# EAGLE design 328pb_squinch_v1 (EAGLE 7.7.0)
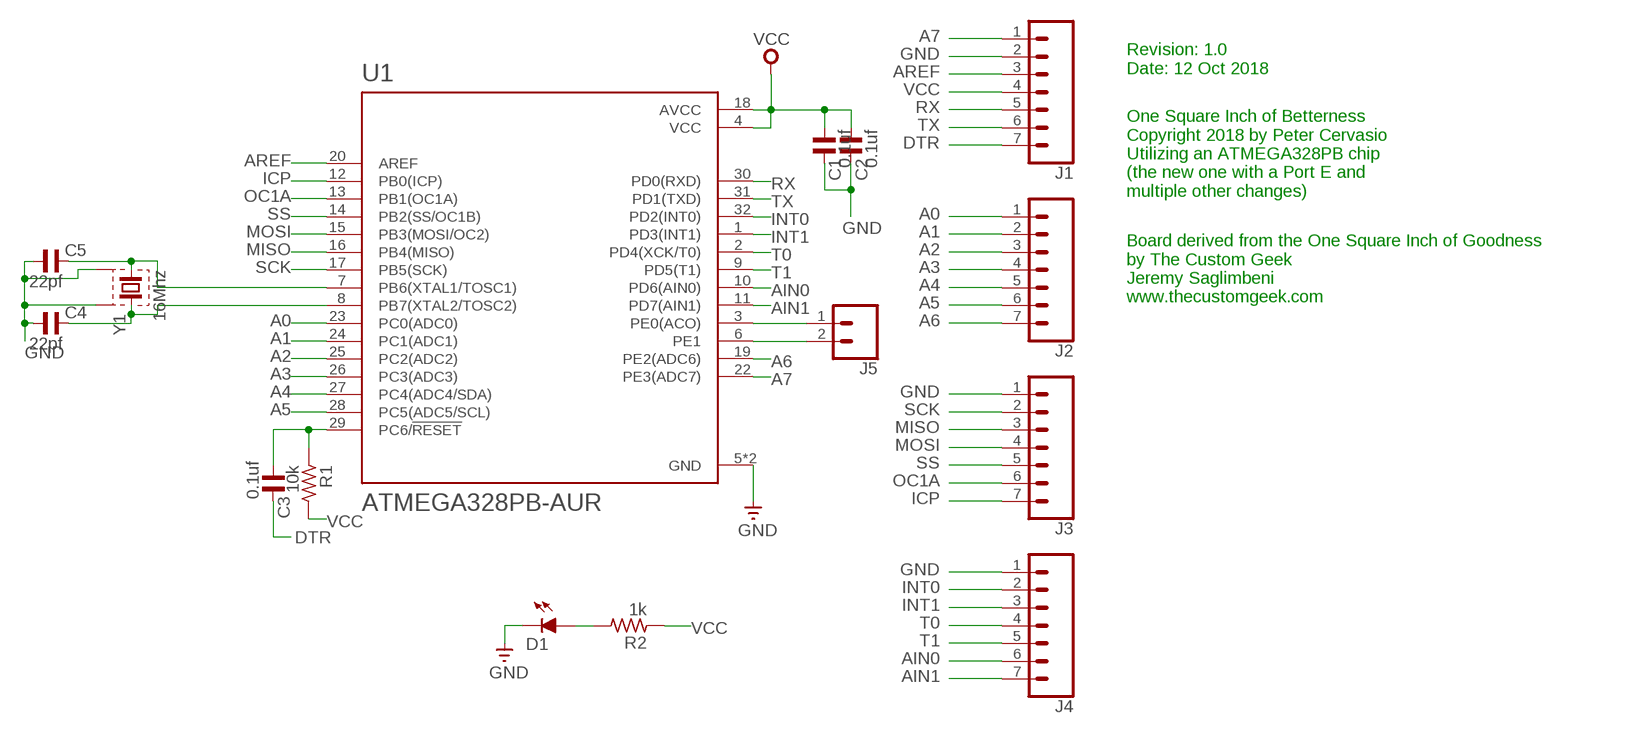
[diagram p0: schematic, sheet 1]

## Parts
C1  0.1uf  C_0603  [C0603]
C2  0.1uf  C_0603  [C0603]
C3  0.1uf  C_0603  [C0603]
C4  22pf  C_0603  [C0603]
C5  22pf  C_0603  [C0603]
D1  LEDCHIPLED_0603  [CHIPLED_0603]
J1  CONN_07  [1X07]
J2  CONN_07  [1X07]
J3  CONN_07  [1X07]
J4  CONN_07  [1X07]
J5  CONN_02  [1X02]
R1  10k  R_0603  [R0603]
R2  1k  R_0603  [R0603]
U1  ATMEGA328PB-AUR  [QFP80P900X900X120-32N]
Y1  16Mhz  ABM3B  [ABM3B]

## Nets
A0: J2.1 U1.23(PC0(ADC0))
A1: J2.2 U1.24(PC1(ADC1))
A2: J2.3 U1.25(PC2(ADC2))
A3: J2.4 U1.26(PC3(ADC3))
A4: J2.5 U1.27(PC4(ADC4/SDA))
A5: J2.6 U1.28(PC5(ADC5/SCL))
A6: J2.7 U1.19(PE2(ADC6))
A7: J1.1 U1.22(PE3(ADC7))
AIN0: J4.6 U1.10(PD6(AIN0))
AIN1: J4.7 U1.11(PD7(AIN1))
AREF: J1.3 U1.20(AREF)
DTR: C3.2 J1.7
GND: C1.1 C2.1 C4.1 C5.1 D1.C J1.2 J3.1 J4.1 U1.5(GND) U1.21(GND) Y1.2 Y1.4
ICP: J3.7 U1.12(PB0(ICP))
INT0: J4.2 U1.32(PD2(INT0))
INT1: J4.3 U1.1(PD3(INT1))
MISO: J3.3 U1.16(PB4(MISO))
MOSI: J3.4 U1.15(PB3(MOSI/OC2))
N$8: C5.2 U1.7(PB6(XTAL1/TOSC1)) Y1.1
N$9: C4.2 U1.8(PB7(XTAL2/TOSC2)) Y1.3
N$16: C3.1 R1.1 U1.29(PC6/!RESET)
N$44: D1.A R2.2
OC1A: J3.6 U1.13(PB1(OC1A))
PE0: J5.1 U1.3(PE0(ACO))
PE1: J5.2 U1.6(PE1)
RX: J1.5 U1.30(PD0(RXD))
SCK: J3.2 U1.17(PB5(SCK))
SS: J3.5 U1.14(PB2(SS/OC1B))
T0: J4.4 U1.2(PD4(XCK/T0))
T1: J4.5 U1.9(PD5(T1))
TX: J1.6 U1.31(PD1(TXD))
VCC: C1.2 C2.2 J1.4 R1.2 R2.1 U1.4(VCC) U1.18(AVCC)

## Notes on the sheet
- Revision: 1.0
  Date: 12 Oct 2018
- One Square Inch of Betterness
  Copyright 2018 by Peter Cervasio
  Utilizing an ATMEGA328PB chip
  (the new one with a Port E and
  multiple other changes)
- Board derived from the One Square Inch of Goodness
  by The Custom Geek
  Jeremy Saglimbeni
  www.thecustomgeek.com

## Library data of the parts
C1-C5 = rc-master-smd:C_: NON-POLARIZED CAP
D1 = led:LED: LED Various Types
J1-J4 = SparkFun-Connectors:CONN_07: Multi connection point. Often used as Generic Header-pin footprint for 0.1 inch spaced/style header connections On any of the 0.1 inch spaced packages, you can populate with these: Break Away Headers - Straight <https://www.sparkfun.com/products/116> (PRT-00116) Break Away Male Headers - Right Angle <https://www.sparkfun.com/products/553> (PRT-00553) Female Headers <https://www.sparkfun.com/products/115> (PRT-00115) Break Away Headers - Machine Pin <https://www.sparkfun.com/products/117> (PRT-00117) Break Away Female Headers - Swiss Machine Pin <https://www.sparkfun.com/products/743> (PRT-00743) For SCREWTERMINALS and SPRING TERMINALS visit here: Screw Terimnals on SparkFun.com <https://www.sparkfun.com/search/results?term=Screw+Terminals> (5mm/3.5mm/2.54mm spacing) This device is also useful as a general connection point to wire up your design to another part of your project. Our various solder wires solder well into these plated through hole pads. Hook-Up Wire - Assortment (Stranded, 22 AWG) <https://www.sparkfun.com/products/11375> (PRT-11375) Hook-Up Wire - Assortment (Solid Core, 22 AWG) <https://www.sparkfun.com/products/11367> (PRT-11367) View the entire wire category on our website here <https://www.sparkfun.com/categories/141> Special notes: Molex polarized connector foot print use with SKU : PRT-08231 with associated crimp pins and housings. 1MM SMD Version SKU: PRT-10208 NOTES ON THE VARIANTS LOCK and LOCK_LONGPADS... This footprint was designed to help hold the alignment of a through-hole component (i.e. 6-pin header) while soldering it into place. You may notice that each hole has been shifted either up or down by 0.005 of an inch from it's more standard position (which is a perfectly straight line). This slight alteration caused the pins (the squares in the middle) to touch the edges of the holes. Because they are alternating, it causes a "brace" to hold the component in place. 0.005 has proven to be the perfect amount of "off-center" position when using our standard breakaway headers. Although looks a little odd when you look at the bare footprint, once you have a header in there, the alteration is very hard to notice. Also,if you push a header all the way into place, it is covered up entirely on the bottom side.
J5 = SparkFun-Connectors:CONN_02: Multi connection point. Often used as Generic Header-pin footprint for 0.1 inch spaced/style header connections On any of the 0.1 inch spaced packages, you can populate with these: Break Away Headers - Straight <https://www.sparkfun.com/products/116> (PRT-00116) Break Away Male Headers - Right Angle <https://www.sparkfun.com/products/553> (PRT-00553) Female Headers <https://www.sparkfun.com/products/115> (PRT-00115) Break Away Headers - Machine Pin <https://www.sparkfun.com/products/117> (PRT-00117) Break Away Female Headers - Swiss Machine Pin <https://www.sparkfun.com/products/743> (PRT-00743) For SCREWTERMINALS and SPRING TERMINALS visit here: Screw Terimnals on SparkFun.com <https://www.sparkfun.com/search/results?term=Screw+Terminals> (5mm/3.5mm/2.54mm spacing) This device is also useful as a general connection point to wire up your design to another part of your project. Our various solder wires solder well into these plated through hole pads. Hook-Up Wire - Assortment (Stranded, 22 AWG) <https://www.sparkfun.com/products/11375> (PRT-11375) Hook-Up Wire - Assortment (Solid Core, 22 AWG) <https://www.sparkfun.com/products/11367> (PRT-11367) View the entire wire category on our website here <https://www.sparkfun.com/categories/141> Special notes: Molex polarized connector foot print use with: PRT-08233 with associated crimp pins and housings. 2.54_SCREWTERM for use with PRT-10571. 3.5mm Screw Terminal footprints for PRT-08084 5mm Screw Terminal footprints for use with PRT-08432
R1 R2 = rc-master-smd:R_: RESISTOR
U1 = ATMEGA328PB-AUR:ATMEGA328PB-AUR: ATmega Series 20 MHz 32 KB Flash 2 KB SRAM 8-Bit Microcontroller - TQFP-32; AVAILABILITY: Unavailable; DESCRIPTION: Avr 32kb f , 1kb Eeprom, 2kb Ram, - 20mhz, Tqfp, Ind Temp, Green 5 v t&r; MF: Microchip; MP: ATMEGA328PB-AUR; PACKAGE: TQFP-32 Atmel; PRICE: None
Y1 = crystal:ABM3B: CRYSTAL - ABRACON ABM3B Series, 5.0 x 3.2 mm

## Board
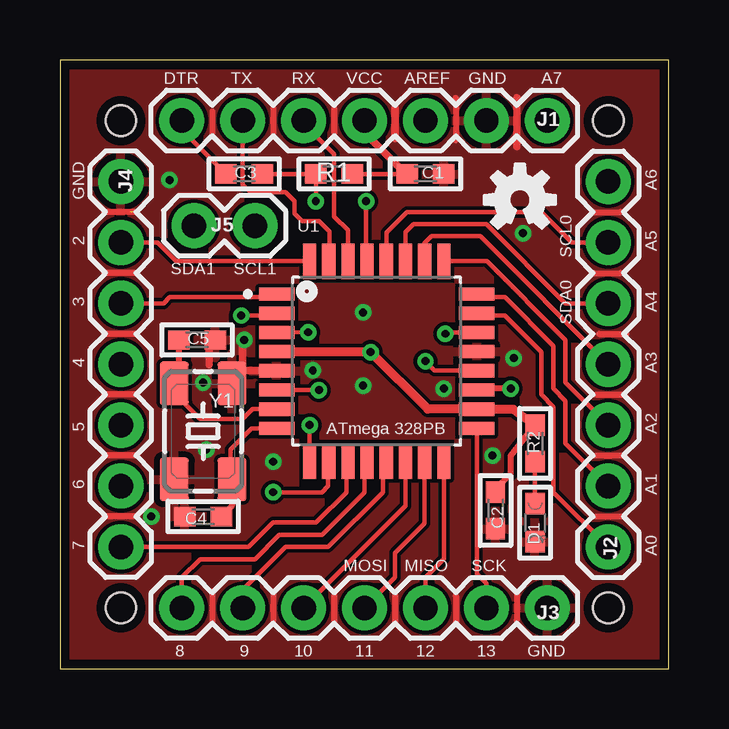
[diagram p1: board, top side]
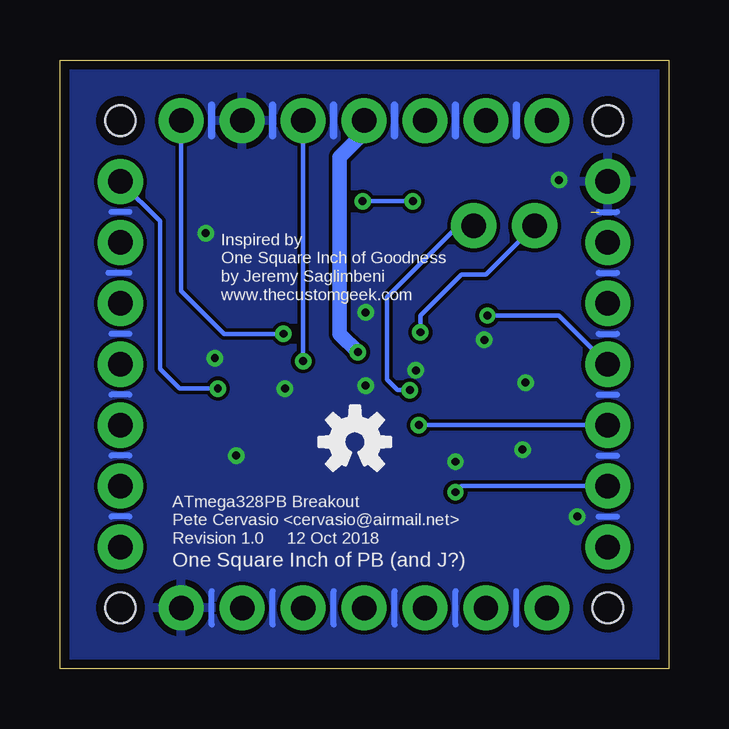
[diagram p2: board, bottom side, seen from below]

Size 25.38 x 25.39 mm. Coordinates in mm from the lower left corner, seen from the top.
Outline: 0,0 25.38,0 25.38,25.39 0,25.39 0,0
Copper layers (1*16): Top 0.0356mm / dielectric 1.5011mm / Bottom 0.0356mm
Design rules "oshpark-2layer": minimum track width 6mil, minimum drill 13mil, track to track 6mil, track to pad 6mil, pad to pad 6mil, via to via 6mil, smd to smd 6mil, copper to edge 15mil, drill to drill 6mil, minimum pad ring 7mil, minimum via ring 7mil, stop-mask expansion 4mil, vias tented up to drill 0mil, thermal gap 10mil
Holes 1.27 mm at 2.54,22.86 22.86,22.86 22.86,2.54 2.54,2.54

### Footprints (pad centres in the part's own frame; a part is rotated, then mirrored left to right if it is on the bottom)
C0603 = smd 0.9 x 0.8: 1 -0.762,0; 2 0.762,0
CHIPLED_0603 = smd 0.8 x 0.9: A 0,-0.794; C 0,0.794
1X07 = drill 1.016 pad 1.88: 1 0,0; 2 2.54,0; 3 5.08,0; 4 7.62,0; 5 10.16,0; 6 12.7,0; 7 15.24,0
1X02 = drill 1.016 pad 1.88: 1 0,0; 2 2.54,0
R0603 = smd 0.9 x 0.8: 1 -0.762,0; 2 0.762,0
QFP80P900X900X120-32N = smd 1.47 x 0.55: 1 -4.17,2.8; 2 -4.17,2; 3 -4.17,1.2; 4 -4.17,0.4; 5 -4.17,-0.4; 6 -4.17,-1.2; 7 -4.17,-2; 8 -4.17,-2.8; 17 4.17,-2.8; 18 4.17,-2; 19 4.17,-1.2; 20 4.17,-0.4; 21 4.17,0.4; 22 4.17,1.2; 23 4.17,2; 24 4.17,2.8 | smd 0.55 x 1.47: 9 -2.8,-4.17; 10 -2,-4.17; 11 -1.2,-4.17; 12 -0.4,-4.17; 13 0.4,-4.17; 14 1.2,-4.17; 15 2,-4.17; 16 2.8,-4.17; 25 2.8,4.17; 26 2,4.17; 27 1.2,4.17; 28 0.4,4.17; 29 -0.4,4.17; 30 -1.2,4.17; 31 -2,4.17; 32 -2.8,4.17
ABM3B = smd 1.8 x 1.2: 1 -2,-1.2; 2 2,-1.2; 3 2,1.2; 4 -2,1.2

### Placement (x,y rotation side)
C1  15.24,20.64 180 top
C2  18.16,6.6 90 top
C3  7.68,20.64 180 top
C4  5.97,6.35 0 top
C5  5.71,13.72 180 top
D1  19.81,6.1 180 top
J1  20.32,22.86 180 top
J2  22.86,5.08 90 top
J3  20.32,2.54 180 top
J4  2.54,20.32 270 top
J5  5.59,18.48 0 top
R1  11.43,20.64 0 top
R2  19.81,9.4 270 top
U1  13.21,12.83 0 top
U$1  [OSHW-LOGO-S]  19.18,19.56 0 top
U$2  [OSHW-LOGO-S]  13.08,9.46 0 bottom
Y1  5.97,9.91 270 top

### Tracks (layer width: path | path; a pad name or v marks a point on that pad's centre or on a via)
A0
  Top 0.178: J2.1 20.57,7.37 20.57,10.92 20.07,11.43 20.07,13.21 18.54,14.73 17.47,14.73
  Top 0.254: 17.47,14.73 U1.23
A1
  Top 0.178: J2.2 21.08,9.4 21.08,11.18 20.57,11.68 20.57,13.46 18.54,15.49 17.51,15.49
  Top 0.254: 17.51,15.49 U1.24
A2
  Top 0.178: U1.25 17.8,17 21.08,13.72 21.08,11.94 J2.3
A3
  Top 0.178: U1.26 15.21,17.75 15.49,18.03 17.53,18.03 J2.4
A4
  Top 0.178: U1.27 14.41,18.22 14.73,18.54 17.78,18.54 21.08,15.24 J2.5
A5
  Top 0.178: U1.28 13.61,18.18 14.48,19.05 20.07,19.05 21.34,17.78 J2.6
A6  (via drill 0.33)
  Top 0.254: v18.8,11.68 17.43,11.68 U1.19
  Bottom 0.178: J2.7 21.21,18.67 21.21,12.5 20.4,11.68 v18.8,11.68
A7  (via drill 0.33)
  Top 0.178: U1.22 16.06,14.03
  Top 0.254: 16.06,14.03 v16.07,13.97
  Bottom 0.178: v16.07,13.97 18.54,13.97 20.32,15.75 J1.1
AIN0  (via drill 0.33)
  Top 0.178: v8.89,7.37 10.92,7.37 11.18,7.62 11.18,8.62
  Top 0.254: 11.18,8.62 U1.10
  Bottom 0.178: J4.6 8.64,7.62 v8.89,7.37
AIN1
  Top 0.178: J4.7 7.87,5.08 8.89,6.1 10.67,6.1 11.94,7.37 11.94,8.59
  Top 0.254: 11.94,8.59 U1.11
AREF  (via drill 0.33)
  Top 0.178: 17.36,12.45 15.62,12.45 v15.24,12.83
  Top 0.254: 17.36,12.45 U1.20
  Bottom 0.178: J1.3 v15.24,12.83
DTR
  Top 0.178: J1.7 5.14,22.8 5.14,22.42 C3.2
GND  (via drill 0.33)  (1 unrouted)
  Top 0.254: 6.35,23.24 6.35,22.35 | 8.89,23.37 8.89,22.35 | 6.35,3.24 6.35,1.91 | 11.43,3.05 11.43,1.91 | 13.97,3.05 13.97,1.91 | 16.51,3.05 16.51,1.91 | 19.05,3.17 19.05,2.03 | 8.89,3.17 8.89,2.03 | 22.35,6.35 23.5,6.35 | 22.35,8.89 23.5,8.89 | 22.35,11.43 23.5,11.43 | 22.48,13.97 23.62,13.97 | 22.23,16.51 23.37,16.51 | 22.23,19.05 23.37,19.05 | 3.24,19.05 1.84,19.05 | 11.43,23.37 11.43,22.35 | 16.51,23.81 16.51,22.04 | 3.24,16.51 1.84,16.51 | 3.24,13.97 1.84,13.97 | 3.24,11.43 1.84,11.43 | 3.24,8.89 1.84,8.89 | 3.24,6.35 1.84,6.35
  Top 0.305: 13.97,23.37 13.97,22.1 | 19.05,21.78 19.05,23.81 | 7.62,13.46 7.62,12.45 8.64,12.45 | 6.22,13.72 6.22,12.7
  Bottom 0.254: 19.05,1.84 19.05,3.24 | 22.48,19.05 23.24,19.05 | 22.48,16.51 23.37,16.51 | 22.48,13.97 23.24,13.97 | 22.48,11.43 23.24,11.43 | 22.48,8.89 23.24,8.89 | 22.48,6.35 23.24,6.35 | 2.92,8.89 2.16,8.89 | 2.92,11.43 2.16,11.43 | 2.92,6.35 2.16,6.35 | 2.92,13.97 2.16,13.97 | 2.92,16.51 2.16,16.51 | 2.92,19.05 2.16,19.05 | 16.51,1.84 16.51,3.24 | 13.97,1.84 13.97,3.24 | 11.43,1.84 11.43,3.24 | 8.89,1.84 8.89,3.24 | 6.35,1.84 6.35,3.24
  Bottom 0.305: 13.97,23.5 13.97,22.23 | 16.51,23.5 16.51,22.23 | 19.05,23.5 19.05,22.23 | 11.43,23.5 11.43,22.23 | 8.89,23.5 8.89,22.23 | 6.35,23.5 6.35,22.23
  other vias: 18.03,8.89 8.89,8.64 10.54,12.45 5.97,11.94 6.1,9.14 3.81,6.35 4.57,20.38 18.92,12.95 19.3,18.16 7.68,13.72 12.64,14.86 16,11.68 12.64,11.81
  pour Top: 0,25.15 25.4,25.15 25.4,0 0,0
  pour Bottom: 0,25.15 25.4,25.15 25.4,0 0,0
ICP
  Top 0.178: 12.7,8.55 12.7,7.37 10.92,5.59 9.14,5.59 8.13,4.57 5.84,4.57 5.08,3.81 J3.7
  Top 0.254: 12.7,8.55 U1.12
INT0
  Top 0.178: U1.32 4.85,17 4.06,17.78 J4.2
INT1
  Top 0.178: 9.14,15.49 4.57,15.49 4.32,15.24 J4.3
  Top 0.254: U1.1 9.04,15.6 9.14,15.49
MISO
  Top 0.178: U1.16 16.01,4.58 15.24,3.81 J3.3
MOSI
  Top 0.178: U1.15 15.21,6.06 13.97,4.83 13.97,3.81 J3.4
N$8
  Top 0.178: U1.7 8.03,10.83 7.62,10.41 5.84,10.41 4.83,11.43
  Top 0.254: C5.2 4.95,12.09 Y1.1 4.83,11.85 4.83,11.43
N$9
  Top 0.178: U1.8 8,10.03 7.11,9.14 7.11,7.96
  Top 0.254: C4.2 7.17,6.79 Y1.3 7.11,7.96
N$16  (via drill 0.33)
  Top 0.178: C3.1 R1.1 v10.67,19.49 | v12.76,19.49 12.76,17.04 U1.29
  Bottom 0.178: v10.67,19.49 v12.76,19.49
N$44
  Top 0.178: R2.2 D1.A
OC1A
  Top 0.178: J3.6 7.62,3.3 9.4,5.08 11.18,5.08 13.46,7.37 13.46,8.51
  Top 0.254: 13.46,8.51 U1.13
PE0  (via drill 0.33)
  Top 0.178: v10.35,14.03 U1.3
  Bottom 0.178: J5.1 7.62,16.45 8.64,16.45 10.35,14.73 v10.35,14.03
PE1  (via drill 0.33)
  Top 0.178: v10.79,11.62 U1.6
  Bottom 0.178: J5.2 8.76,18.48 11.75,15.49 11.75,12.06 11.3,11.62 v10.79,11.62
RX
  Top 0.178: J1.5 10.16,22.73 11.43,21.46 11.43,18.86 12,18.29 U1.30
SCK
  Top 0.178: U1.17 17.38,3.96 17.78,3.56 J3.2
SS
  Top 0.178: U1.14 14.41,6.79 J3.5
T0  (via drill 0.33)
  Top 0.178: v7.56,14.73 9.13,14.73
  Top 0.254: 9.13,14.73 U1.2
  Bottom 0.178: J4.4 4.57,14.73 v7.56,14.73
T1  (via drill 0.33)
  Top 0.178: v10.41,10.16 U1.9
  Top 0.254: U1.9
  Bottom 0.178: J4.5 v10.41,10.16
TX
  Top 0.178: J1.6 7.62,20.19 7.94,19.88 9.4,19.88 9.78,19.49 9.78,18.99 10.1,18.67 10.79,18.67 11.24,18.22 11.24,17.03 U1.31
VCC  (via drill 0.33)
  Top 0.178: R1.2 C1.2
  Top 0.254: C2.2 18.16,7.49 18.8,8.13 18.8,8.89 R2.1
  Top 0.305: C1.2 14.22,20.83 12.7,22.35 J1.4
  Top 0.381: U1.4 9.06,13.21 v12.95,13.21 15.34,10.83 U1.18 18.89,10.83 R2.1
  Bottom 0.61: J1.4 12.7,22.35 13.72,21.34 13.72,13.97 v12.95,13.21

### Text on the board
tPlace: DTR | TX | RX | VCC | AREF | GND | A7 | A6 | GND | 2 | A5 | SDA1 | SCL1 | SCL0 | A4 | 3 | SDA0 | 4 | A3 | A2 | 5 | ATmega 328PB | A1 | 6 | A0 | 7 | MOSI | MISO | SCK | 8 | 9 | 10 | 11 | 12 | 13 | GND
bPlace: Inspired by / One Square Inch of Goodness / by Jeremy Saglimbeni / www.thecustomgeek.com | ATmega328PB Breakout / Pete Cervasio <cervasio@airmail.net> / Revision 1.0 12 Oct 2018 | One Square Inch of PB (and J?)